# Altium schematic sheet Buzzer.SchDoc
size B; Organization: Altium Limited; Address1: L3, 12a Rodborough Rd; Address2: Frenchs Forest; Address3: NSW; Address4: Australia 2086; DocumentNumber: 2; SheetNumber: 2; SheetTotal: 3
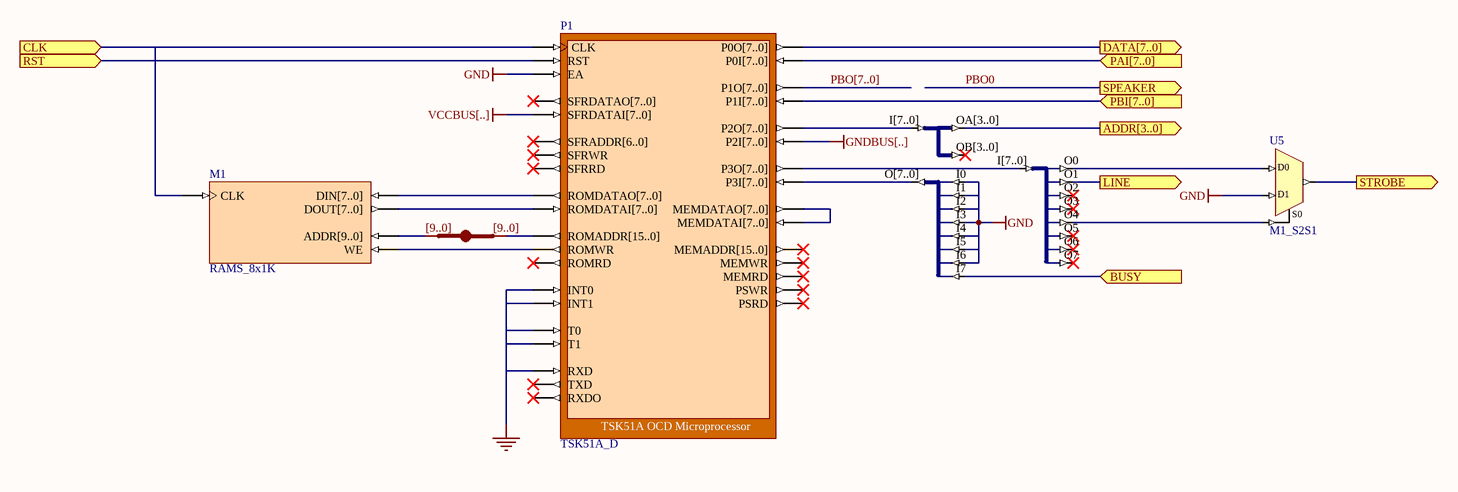
[diagram p0: Buzzer.SchDoc]

## Parts
M1  RAMS_8x1K
P1  TSK51A_D
U2  IndexA: [9..0]  (hidden comment: JB)
U5  M1_S2S1
U9  J8B_8S  (value not drawn)
U10  J8B_4B2  (value not drawn)
U11  J8S_8B  (value not drawn)

## Ports
ADDR[3..0] (out), BUSY (in), CLK (in), DATA[7..0] (out), LINE (out), PAI[7..0] (in), PBI[7..0] (in), RST (in), SPEAKER (out), STROBE (out)

## Nets
GND: P1.EA P1.INT0 P1.INT1 P1.RXD P1.T0 P1.T1 U5.D1 U11.I0 U11.I1 U11.I2 U11.I3 U11.I4 U11.I5 U11.I6
GNDBUS[..]: P1.P2I[7..0]
VCCBUS[..]: P1.SFRDATAI[7..0]
ADDR[3..0]: U10.OA[3..0] ; port ADDR[3..0]
BUSY: U11.I7 ; port BUSY
CLK: M1.CLK P1.CLK ; port CLK
DATA[7..0]: P1.P0O[7..0] ; port DATA[7..0]
LINE: U9.O1 ; port LINE
PAI[7..0]: P1.P0I[7..0] ; port PAI[7..0]
PBI[7..0]: P1.P1I[7..0] ; port PBI[7..0]
PBO0: port SPEAKER
PBO[7..0]: P1.P1O[7..0]
RST: P1.RST ; port RST
STROBE: U5.O ; port STROBE
NetM1_ADDR[9..0]: M1.ADDR[9..0] U2.B[0..0]
NetM1_DIN[7..0]: M1.DIN[7..0] P1.ROMDATAO[7..0]
NetM1_DOUT[7..0]: M1.DOUT[7..0] P1.ROMDATAI[7..0]
NetM1_WE: M1.WE P1.ROMWR
NetP1_MEMDATAI[7..0]: P1.MEMDATAI[7..0] P1.MEMDATAO[7..0]
NetP1_P2O[7..0]: P1.P2O[7..0] U10.I[7..0]
NetP1_P3I[7..0]: P1.P3I[7..0] U11.O[7..0]
NetP1_P3O[7..0]: P1.P3O[7..0] U9.I[7..0]
NetP1_ROMADDR[15..0]: P1.ROMADDR[15..0] U2.A[0..0]
NetU5_D0: U5.D0 U9.O0
NetU5_S0: U5.S0 U9.O4

Not connected (* = marked no-connect by the designer): P1 MEMADDR[15..0]* MEMRD* MEMWR* PSRD* PSWR* ROMRD* RXDO* SFRADDR[6..0]* SFRDATAO[7..0]* SFRRD* SFRWR* TXD*; U9 O2* O3* O5* O6* O7*; U10 OB[3..0]*

## Buses and harness runs
bus PBO[7..0]

## Notes on the sheet
- Title
- Size:
- Date:
- B
- Number:
- Time:
- Revision:
- Sheet
- of
- File:

## Library data of the parts
M1 = RAMS_8x1K: Single Port Random Access Memory; Memory_Depth: 1024; Memory_Type: RAM_SinglePortBlock; Memory_Width: 8; Memory_ClockEdge: Rising; Nexus_Core: Memory_Program; Published: 13/01/2004; Publisher: Altium Hobart Technology Center
P1 = TSK51A_D: TSK51A OCD Microprocessor; NEXUS_CORE: Processor_OCDS; NEXUS_JTAG_DEVICE: True; NEXUS_JTAG_ORDER: 0; ChildModel1: RAM256x8_TSK51D; ChildCore1: M1; Published: 10/11/2003; Publisher: Altium Hobart Technology Centre; Core Revision: 1.00.00
U2 = JB: System BUS Joiner; ArchiveName: GENERIC; Published: 18-Dec-2003; Publisher: Altium Limited; Core Revision: 1.00.00; IndexB: [9..0]
U5 = M1_S2S1: 2x1-Single Wire to 1x1-Single Wire Multiplexer; Xilinx Equivalent: M2_1; ArchiveName: GENERIC; VHDLIB_SIM: GENERIC_LIB; Published: 28-Jan-2004; Publisher: Altium Limited; Core Revision: 1.00.00
U9 = J8B_8S: 8-Bit input bus to 8 single pin outputs; ArchiveName: GENERIC; Published: 18-Dec-2003; Publisher: Altium Limited; Core Revision: 1.00.00
U10 = J8B_4B2: 1 x 8-bit input bus to 2 x 4-Bit output bus; ArchiveName: GENERIC; Published: 18-Dec-2003; Publisher: Altium Limited; Core Revision: 1.00.00
U11 = J8S_8B: 8 Single pin inputs to single 8-Bit output bus; ArchiveName: GENERIC; Published: 18-Dec-2003; Publisher: Altium Limited; Core Revision: 1.00.00